# EAGLE schematic RoundESPtestbd (EAGLE 7.6.0)
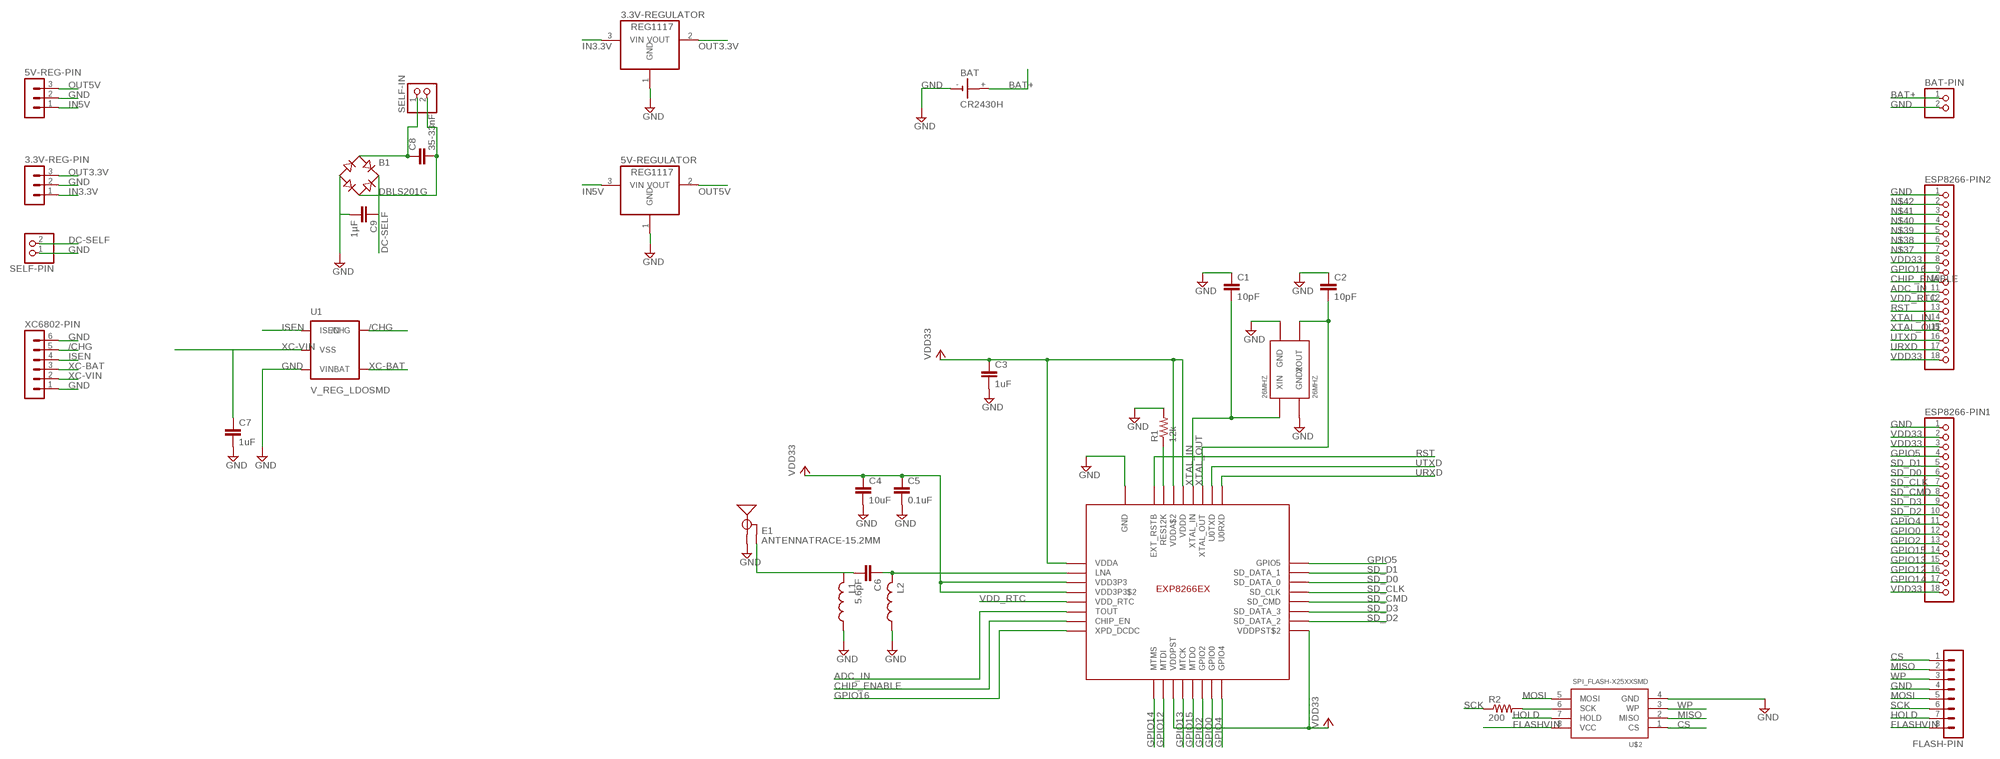
[diagram p0: schematic, sheet 1]

## Parts
3.3V-REG-PIN  MA03-1  [MA03-1]
3.3V-REGULATOR  REG1117  [SOT223]
5V-REG-PIN  MA03-1  [MA03-1]
5V-REGULATOR  REG1117  [SOT223]
26MHZ  26MHZ  33MHZ-OSCILLATOR  [CRYSTAL-OSC-SMD-5X3.2]
B1  DBLS201G  [DBS]
BAT  CR2430H  [CR2430H]
BAT-PIN  PINHD-1X2  [1X02]
C1  10pF  C2,5-3  [C2.5-3]
C2  10pF  C2,5-3  [C2.5-3]
C3  1uF  C2,5-3  [C2.5-3]
C4  10uF  C2,5-3  [C2.5-3]
C5  0.1uF  C2,5-3  [C2.5-3]
C6  5.6pF  C2,5-3  [C2.5-3]
C7  1uF  C2,5-3  [C2.5-3]
C8  35-33nF  C2,5-3  [C2.5-3]
C9  1µF  C2,5-3  [C2.5-3]
E1  ANTENNATRACE-15.2MM  [TRACE_ANTENNA_2.4GHZ_15.2MM]
ESP8266-PIN1  PINHD-1X18  [1X18]
ESP8266-PIN2  PINHD-1X18  [1X18]
FLASH-PIN  MA08-1  [MA08-1]
L1  L-USL2012C  [L2012C]
L2  L-USL2012C  [L2012C]
R1  12k  R-US_M0805  [M0805]
R2  200  R-US_M0805  [M0805]
SELF-IN  PINHD-1X2  [1X02]
SELF-PIN  PINHD-1X2  [1X02]
U1  V_REG_LDOSMD  [SOT23-5]
U2  ESP8266EX  [ESP8266EX]
U$2  SPI_FLASH-X25XXSMD  [SO08]
XC6802-PIN  MA06-1  [MA06-1]

## Nets
111: R2.2 U$2.6(SCK)
/CHG: U1.5(/CHG) XC6802-PIN.5
ADC_IN: ESP8266-PIN2.11 U2.TOUT
BAT+: BAT-PIN.1 BAT.+
CHIP_ENABLE: ESP8266-PIN2.10 U2.CHIP_EN
CS: FLASH-PIN.1 U$2.1(CS)
DC-SELF: B1.+ C9.1 SELF-PIN.2
FLASHVIN: FLASH-PIN.8 U$2.8(VCC)
GND: 3.3V-REG-PIN.2 3.3V-REGULATOR.1(GND) 5V-REG-PIN.2 5V-REGULATOR.1(GND) 26MHZ.1(GND2) 26MHZ.3(GND) B1.- BAT-PIN.2 BAT.- C1.1 C2.1 C3.2 C4.2 C5.2 C9.2 E1.ANT(SIGNAL) ESP8266-PIN1.1 ESP8266-PIN2.1 FLASH-PIN.4 L1.1 L2.1 R1.2 SELF-PIN.1 U1.2(VIN) U2.GND U$2.4(GND) XC6802-PIN.1 XC6802-PIN.6
GPIO0: ESP8266-PIN1.12 U2.GPIO0
GPIO2: ESP8266-PIN1.13 U2.GPIO2
GPIO4: ESP8266-PIN1.11 U2.GPIO4
GPIO5: ESP8266-PIN1.4 U2.GPOIO5(GPIO5)
GPIO12: ESP8266-PIN1.16 U2.MTDI
GPIO13: ESP8266-PIN1.15 U2.MTCK
GPIO14: ESP8266-PIN1.17 U2.MTMS
GPIO15: ESP8266-PIN1.14 U2.MTDO
GPIO16: ESP8266-PIN2.9 U2.XPD_DCDC
HOLD: FLASH-PIN.7 U$2.7(HOLD)
IN3.3V: 3.3V-REG-PIN.1 3.3V-REGULATOR.3(VIN)
IN5V: 5V-REG-PIN.1 5V-REGULATOR.3(VIN)
ISEN: U1.1(ISEN) XC6802-PIN.4
MISO: FLASH-PIN.2 U$2.2(MISO)
MOSI: FLASH-PIN.5 U$2.5(MOSI)
N$2: C6.1 L2.2 U2.LNA
N$3: C6.2 E1.GND L1.2
N$5: R1.1 U2.RES12K
N$6: B1.AC1 C8.1 SELF-IN.1
N$7: B1.AC2 C8.2 SELF-IN.2
N$37: ESP8266-PIN2.7
N$38: ESP8266-PIN2.6
N$39: ESP8266-PIN2.5
N$40: ESP8266-PIN2.4
N$41: ESP8266-PIN2.3
N$42: ESP8266-PIN2.2
OUT3.3V: 3.3V-REG-PIN.3 3.3V-REGULATOR.2(VOUT)
OUT5V: 5V-REG-PIN.3 5V-REGULATOR.2(VOUT)
RST: ESP8266-PIN2.13 U2.EXT_RSTB
SCK: FLASH-PIN.6 R2.1
SD_CLK: ESP8266-PIN1.7 U2.SD_CLK
SD_CMD: ESP8266-PIN1.8 U2.SD_CMD
SD_D0: ESP8266-PIN1.6 U2.SD_DATA_0
SD_D1: ESP8266-PIN1.5 U2.SD_DATA_1
SD_D2: ESP8266-PIN1.10 U2.SD_DATA_2
SD_D3: ESP8266-PIN1.9 U2.SD_DATA_3
URXD: ESP8266-PIN2.17 U2.U0RXD
UTXD: ESP8266-PIN2.16 U2.U0TXD
VDD33: C3.1 C4.1 C5.1 ESP8266-PIN1.2 ESP8266-PIN1.3 ESP8266-PIN1.18 ESP8266-PIN2.8 ESP8266-PIN2.18 U2.VDD3P3 U2.VDD3P3$2 U2.VDDA U2.VDDA$2 U2.VDDD U2.VDDPST U2.VDDPST$2
VDD_RTC: ESP8266-PIN2.12 U2.VDD_RTC
WP: FLASH-PIN.3 U$2.3(WP)
XC-BAT: U1.4(BAT) XC6802-PIN.3
XC-VIN: C7.1 U1.3(VSS) XC6802-PIN.2
XTAL_IN: 26MHZ.4(XIN) C1.2 ESP8266-PIN2.14 U2.XTAL_IN
XTAL_OUT: 26MHZ.2(XOUT) C2.2 ESP8266-PIN2.15 U2.XTAL_OUT
Unconnected: BAT.+@1(+) C7.2

## Library data of the parts
3.3V-REG-PIN 5V-REG-PIN = con-lstb:MA03-1: PIN HEADER; OC_FARNELL: unknown; OC_NEWARK: unknown
3.3V-REGULATOR 5V-REGULATOR = burr-brown:REG1117: 800mA and 1A Low Dropout (LDO) Positive Regulator 1.8V, 2.5V, 2.85V, 3.3V, 5V, and Adj; MPN: REG1117; OC_FARNELL: 1097566; OC_NEWARK: 14P6981
26MHZ = SparkFun-FreqCtrl:33MHZ-OSCILLATOR: Generic 5x3.2 Oscillator; PROD_ID: XTAL-11986
B1 = rectifier:DB?*G: Single Phase 1.0 AMP Glass Passivated Bridge Rectifier Taiwan Semiconductor Co.,Ltd. - TSC Source: http://www.taiwansemi.com/TSCbig5/ezcatfiles/cust/img/img/db101g.pdf http://www.ts.com.tw/db/pictures/modules/PDT/PDT060207001/DBLS201G.pdf
BAT = battery:CR2430H: LI BATTERY Varta
BAT-PIN SELF-IN SELF-PIN = pinhead:PINHD-1X2: PIN HEADER
C1-C9 = capacitor-wima:C: CAPACITOR naming: grid - package width
E1 = SparkFun-RF:ANTENNA: Chip antenna Chip antenna with ground or secondary connection. Common with larger metal RF connectors.
ESP8266-PIN1 ESP8266-PIN2 = pinhead:PINHD-1X18: PIN HEADER
FLASH-PIN = con-lstb:MA08-1: PIN HEADER; OC_FARNELL: unknown; OC_NEWARK: unknown
L1 L2 = resistor:L-US: INDUCTOR, American symbol
R1 R2 = rcl:R-US_: RESISTOR, American symbol
U1 = SparkFun-PowerIC:V_REG_LDO: Voltage Regulator LDO Standard 150mA LDO voltage regulator in SOT-23 layout. Micrel part MIC5205. BP (by-pass) pin is used to lower output noise with 470pF cap.
U2 = ESP8266EX:ESP8266EX
U$2 = SparkFun-DigitalIC:SPI_FLASH-X25XX: 8pin SPI Flash series x25xx. Works with devices like W25X32 and BR25L32
XC6802-PIN = con-lstb:MA06-1: PIN HEADER; OC_FARNELL: unknown; OC_NEWARK: unknown

## Module CRYSTAL26MHZ
Ports: GND(io) XIN(io) XOUT(io) GND2(io)

### Library data of the parts